# Altium schematic sheet hub_board.SchDoc: Hall / Hub Board
size A4; DocumentNumber: 1; SheetNumber: 1; SheetTotal: 7
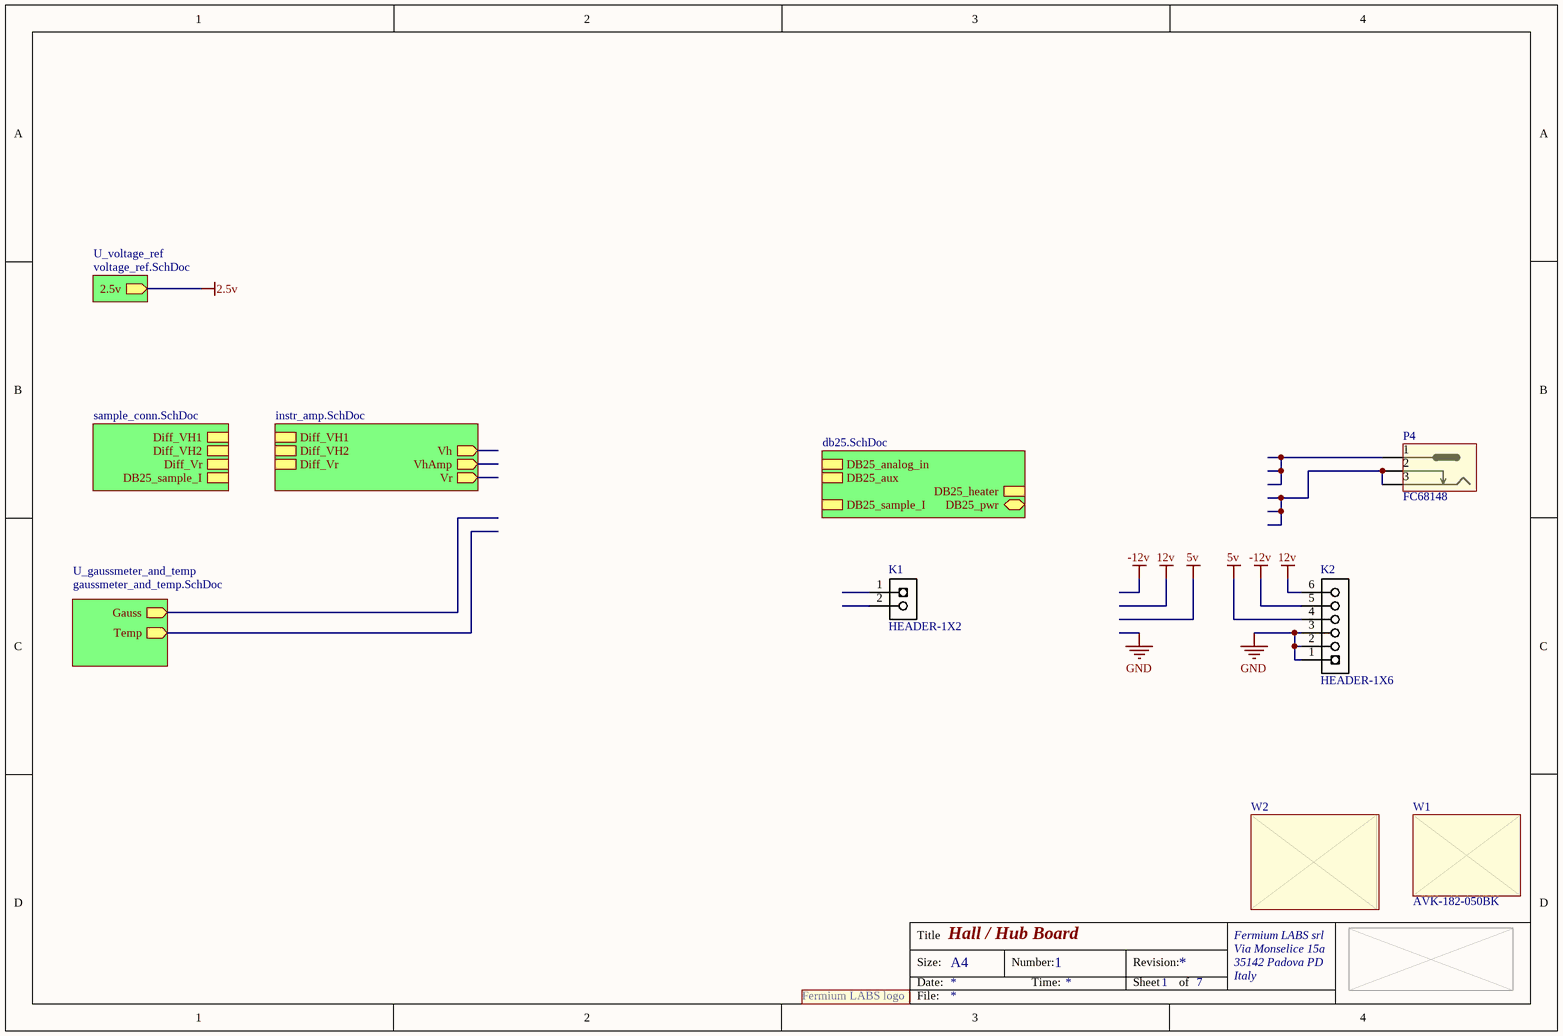
[diagram p0: hub_board.SchDoc]

## Parts
K1  HEADER-1X2  [HEADER-1X2]  (no BOM)
K2  HEADER-1X6  [HEADER-1X6]  (no BOM)
logo  fermiumlabs-logo  [frm-med]  (value not drawn)  (no BOM)
P4  Supplier Part Number 1: FC68148  [dc-jack]
W1  AVK-182-050BK  (mechanical)
W2  (no value)  (mechanical)

## Sub-sheets
U_db25 = db25.SchDoc: DB25_aux (harness DB25_aux), DB25_heater (harness DB25_heater), DB25_sample_I (harness DB25_sample_I), DB25_analog_in (harness DB25_analog_in), DB25_pwr (harness DB25_pwr)
U_gaussmeter_and_temp = gaussmeter_and_temp.SchDoc: Temp (out), Gauss (out)
U_instr_amp = instr_amp.SchDoc: Vh (out), Vr (out), VhAmp (out), Diff_VH1 (harness Diff_VH1), Diff_Vr (harness Diff_Vr), Diff_VH2 (harness Diff_VH2)
U_sample_conn = sample_conn.SchDoc: Diff_Vr (harness Diff_Vr), Diff_VH1 (harness Diff_VH1), Diff_VH2 (harness Diff_VH2), DB25_sample_I (harness DB25_sample_I)
U_voltage_ref = voltage_ref.SchDoc: 2.5v (out)

## Nets
2.5v: sheet U_voltage_ref/2.5v
5v: K2.4
12v: K2.6
-12v: K2.5
GND: K2.1 K2.2 K2.3
NetP4_2: P4.2 P4.3

Not connected (* = marked no-connect by the designer): K1 1 2; P4 1

## Notes on the sheet
- Title
- Size:
- Date:
- A4
- Number:
- Time:
- Revision:
- Sheet
- of
- Fermium LABS srl
- Via Monselice 15a
- 35142 Padova PD
- Italy
- File:
- (in symbol fermiumlabs-logo) Fermium LABS logo

## Library data of the parts
P4 = jackdc: Manufacturer: CLIFF; Manufacturer Part Number: DC-10A FC68148; Pads: 3 THT; Supplier 1: TME
W1 = AVK-182-050BK: Manufacturer Part Number: 63824; Manufacturer: GOOBAY; Supplier 1: TME; Supplier Part Number 1: AVK-182-050BK
W2 = CAB-25WW/2: Manufacturer: BQ CABLE; Supplier 1: TME; Manufacturer Part Number: CAB-25WW/2; Supplier part Number 1: CAB-25WW/2